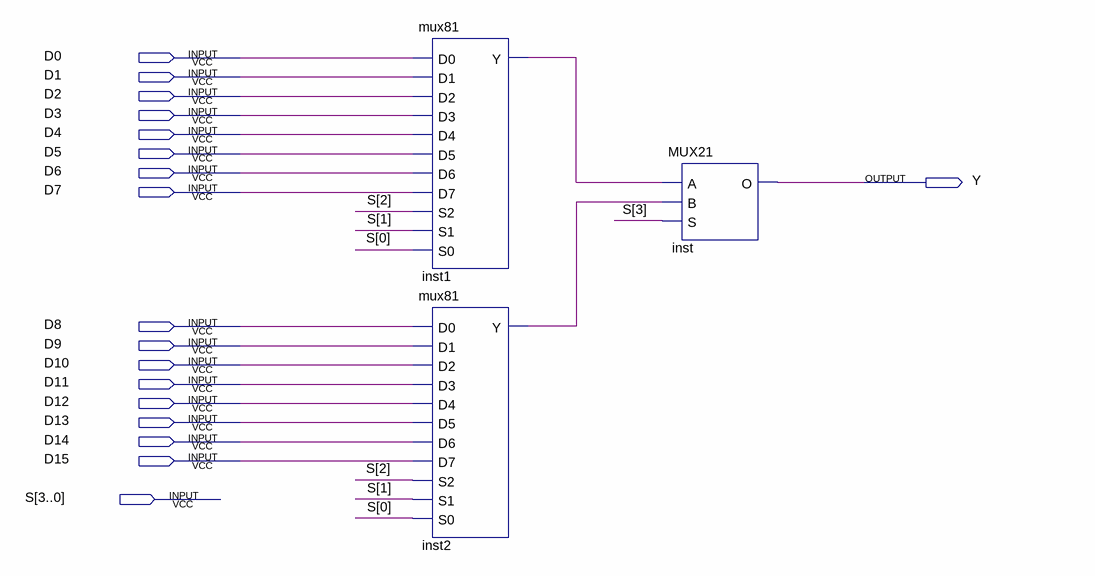
[diagram p0: schematic sheet]
// Quartus schematic mux161.bdf as structural Verilog: 3 symbols, 18 pins
module mux161 (
  input  D0,
  input  D1,
  input  D2,
  input  D3,
  input  D4,
  input  D5,
  input  D6,
  input  D7,
  input  D8,
  input  D9,
  input  D10,
  input  D11,
  input  D12,
  input  D13,
  input  D14,
  input  D15,
  input  [3:0] S,
  output Y
);

  wire inst1_y, inst2_y;

  mux81 inst1 (
    .D0(D0), .D1(D1), .D2(D2), .D3(D3), .D4(D4), .D5(D5), .D6(D6), .D7(D7), .S2(S[2]), .S1(S[1]), .S0(S[0]),
    .Y(inst1_y));
  mux81 inst2 (
    .D0(D8), .D1(D9), .D2(D10), .D3(D11), .D4(D12), .D5(D13), .D6(D14), .D7(D15), .S2(S[2]), .S1(S[1]),
    .S0(S[0]), .Y(inst2_y));
  MUX21 inst (.A(inst1_y), .S(S[3]), .B(inst2_y), .O(Y));
endmodule
